# EAGLE design Tip_Tilt_Controller (EAGLE 9.4.2)
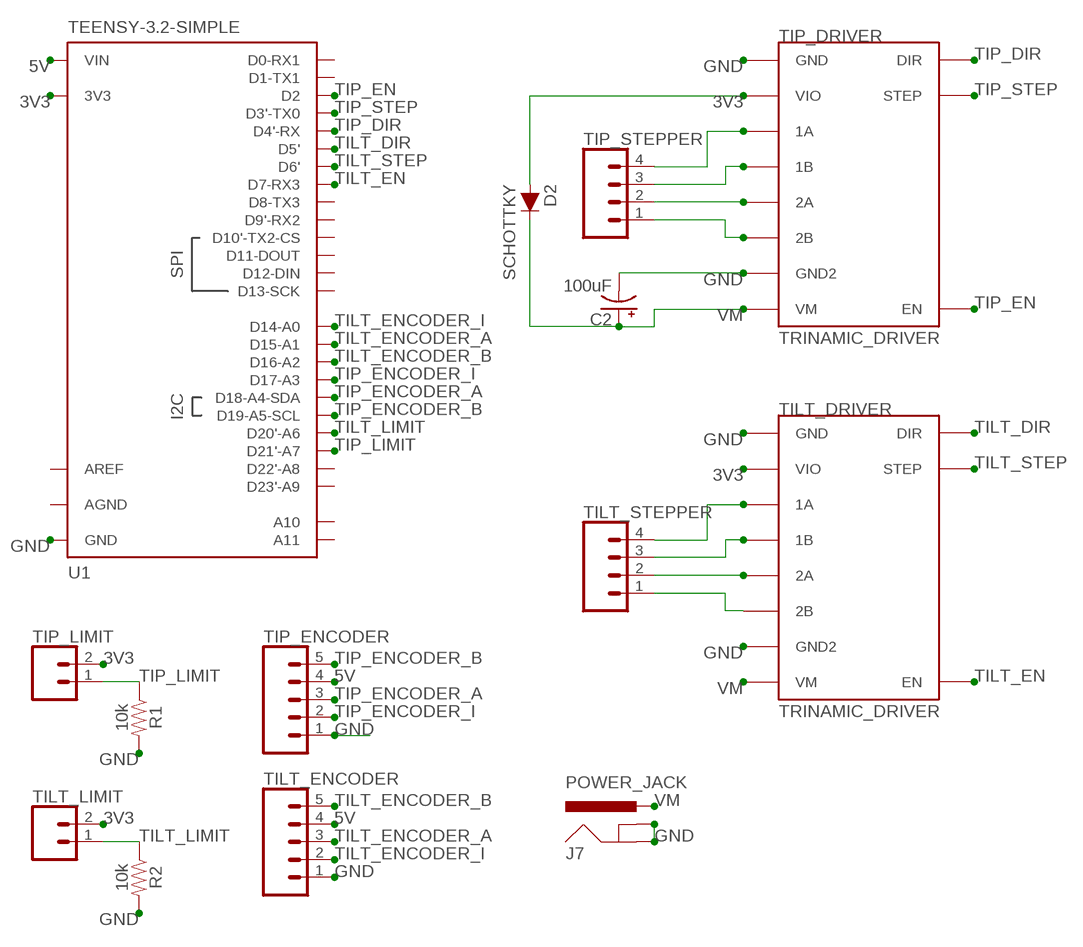
[diagram p0: schematic, sheet 1]

## Parts
C2  100uF  100UF-POLAR-RADIAL-2.5MM-25V-20%  [CPOL-RADIAL-2.5MM-6.5MM]
D2  SCHOTTKY  DIODE-1N4148  [DIODE-1N4148]
J7  POWER_JACK  [POWER_JACK_PTH]
R1  10k  10KOHM-HORIZ-1/6W-5%  [AXIAL-0.3]
R2  10k  10KOHM-HORIZ-1/6W-5%  [AXIAL-0.3]
TILT_DRIVER  TRINAMIC_DRIVER  [TRINAMIC_DRIVER]
TILT_ENCODER  CONN_05  [1X05]
TILT_LIMIT  CONN_02  [1X02]
TILT_STEPPER  CONN_04PTH  [1X04]
TIP_DRIVER  TRINAMIC_DRIVER  [TRINAMIC_DRIVER]
TIP_ENCODER  CONN_05  [1X05]
TIP_LIMIT  CONN_02  [1X02]
TIP_STEPPER  CONN_04PTH  [1X04]
U1  TEENSY-3.2-SIMPLE  [TEENSY-3.2-SIMPLE]

## Nets
3V3: D2.A TILT_DRIVER.5V(VIO) TILT_LIMIT.2 TIP_DRIVER.5V(VIO) TIP_LIMIT.2 U1.3.3V(3V3)
5V: TILT_ENCODER.4 TIP_ENCODER.4 U1.VIN
GND: C2.2(-) J7.GND J7.GNDBREAK R1.P$2 R2.P$2 TILT_DRIVER.GND TILT_DRIVER.GND2 TILT_ENCODER.1 TIP_DRIVER.GND TIP_DRIVER.GND2 TIP_ENCODER.1 U1.GND
N$10: TIP_DRIVER.1A TIP_STEPPER.4
N$11: TIP_DRIVER.1B TIP_STEPPER.3
N$12: TIP_DRIVER.2A TIP_STEPPER.2
N$13: TIP_DRIVER.2B TIP_STEPPER.1
N$18: TILT_DRIVER.1A TILT_STEPPER.4
N$19: TILT_DRIVER.1B TILT_STEPPER.3
N$20: TILT_DRIVER.2A TILT_STEPPER.2
N$21: TILT_DRIVER.2B TILT_STEPPER.1
TILT_DIR: TILT_DRIVER.DIR U1.5(D5')
TILT_EN: TILT_DRIVER.EN U1.7(D7-RX3)
TILT_ENCODER_A: TILT_ENCODER.3 U1.15(D15-A1)
TILT_ENCODER_B: TILT_ENCODER.5 U1.16(D16-A2)
TILT_ENCODER_I: TILT_ENCODER.2 U1.14(D14-A0)
TILT_LIMIT: R2.P$1 TILT_LIMIT.1 U1.20(D20'-A6)
TILT_STEP: TILT_DRIVER.STEP U1.6(D6')
TIP_DIR: TIP_DRIVER.DIR U1.4(D4'-RX)
TIP_EN: TIP_DRIVER.EN U1.2(D2)
TIP_ENCODER_A: TIP_ENCODER.3 U1.18(D18-A4-SDA)
TIP_ENCODER_B: TIP_ENCODER.5 U1.19(D19-A5-SCL)
TIP_ENCODER_I: TIP_ENCODER.2 U1.17(D17-A3)
TIP_LIMIT: R1.P$1 TIP_LIMIT.1 U1.21(D21'-A7)
TIP_STEP: TIP_DRIVER.STEP U1.3(D3'-TX0)
VM: C2.1(+) D2.C J7.PWR TILT_DRIVER.VM TIP_DRIVER.VM
Unconnected: U1.0(D0-RX1) U1.1(D1-TX1) U1.8(D8-TX3) U1.9(D9'-RX2) U1.10(D10'-TX2-CS) U1.11(D11-DOUT) U1.12(D12-DIN) U1.13(D13-SCK) U1.22(D22'-A8) U1.23(D23'-A9) U1.A10 U1.A11

## Power pins joined to a net without a drawn wire
AGND: U1.AGND
AREF: U1.AREF

## Library data of the parts
C2 = SparkFun-Capacitors:100UF-POLAR: 100µF polarized capacitors A capacitor is a passive two-terminal electrical component used to store electrical energy temporarily in an electric field.; PROD_ID: CAP-08439
D2 = SparkFun-DiscreteSemi:DIODE: Diode These are standard reverse protection diodes and small signal diodes. SparkFun Products: SparkFun SparkPunk Sound Kit <https://www.sparkfun.com/products/11177> SparkFun ESP8266 Thing <https://www.sparkfun.com/products/13231>; PROD_ID: DIO-08378; VALUE: 200mA/100V/1V
J7 = SparkFun-Connectors:POWER_JACK: Power Jack Connector This is the standard 5.5mm barrel jack for power. The PTH is the most common, proven, reliable, footprint. The Slot footprint only works if the mill layer is transmitted to the PCB fab house so be warned. Here are the connectors we sell at SparkFun: DC Barrel Power Jack/Connector <https://www.sparkfun.com/products/119> (PRT-00119) DC Barrel Power Jack/Connector (SMD) <https://www.sparkfun.com/products/12748> (PRT-12748) DC Barrel Jack Adapter - Breadboard Compatible <https://www.sparkfun.com/products/10811> (PRT-10811) It is used on this SparkFun product (and many, many others): SparkFun RedBoard - Programmed with Arduino <https://www.sparkfun.com/products/12757> (DEV-12757) Also, if you need a mating power supply or connector, please check these out: Wall Adapter Power Supply - 9VDC 650mA <https://www.sparkfun.com/products/298> (TOL-00298) DC Barrel Jack Adapter - Male <https://www.sparkfun.com/products/10287> (PRT-10287); PROD_ID: CONN-08197
R1 R2 = SparkFun-Resistors:10KOHM: 10kΩ resistor A resistor is a passive two-terminal electrical component that implements electrical resistance as a circuit element. Resistors act to reduce current flow, and, at the same time, act to lower voltage levels within circuits. - Wikipedia; PROD_ID: RES-08375
TILT_DRIVER TIP_DRIVER = My Library:TRINAMIC_DRIVER
TILT_ENCODER TIP_ENCODER = SparkFun-Connectors:CONN_05: Multi connection point. Often used as Generic Header-pin footprint for 0.1 inch spaced/style header connections On any of the 0.1 inch spaced packages, you can populate with these: Break Away Headers - Straight <https://www.sparkfun.com/products/116> (PRT-00116) Break Away Male Headers - Right Angle <https://www.sparkfun.com/products/553> (PRT-00553) Female Headers <https://www.sparkfun.com/products/115> (PRT-00115) Break Away Headers - Machine Pin <https://www.sparkfun.com/products/117> (PRT-00117) Break Away Female Headers - Swiss Machine Pin <https://www.sparkfun.com/products/743> (PRT-00743) For SCREWTERMINALS and SPRING TERMINALS visit here: Screw Terimnals on SparkFun.com <https://www.sparkfun.com/search/results?term=Screw+Terminals> (5mm/3.5mm/2.54mm spacing) This device is also useful as a general connection point to wire up your design to another part of your project. Our various solder wires solder well into these plated through hole pads. Hook-Up Wire - Assortment (Stranded, 22 AWG) <https://www.sparkfun.com/products/11375> (PRT-11375) Hook-Up Wire - Assortment (Solid Core, 22 AWG) <https://www.sparkfun.com/products/11367> (PRT-11367) View the entire wire category on our website here <https://www.sparkfun.com/categories/141> Special notes: Molex polarized connector foot print use with SKU : PRT-08231 with associated crimp pins and housings. 1MM SMD Version SKU: PRT-10208
TILT_LIMIT TIP_LIMIT = SparkFun-Connectors:CONN_02: Multi connection point. Often used as Generic Header-pin footprint for 0.1 inch spaced/style header connections On any of the 0.1 inch spaced packages, you can populate with these: Break Away Headers - Straight <https://www.sparkfun.com/products/116> (PRT-00116) Break Away Male Headers - Right Angle <https://www.sparkfun.com/products/553> (PRT-00553) Female Headers <https://www.sparkfun.com/products/115> (PRT-00115) Break Away Headers - Machine Pin <https://www.sparkfun.com/products/117> (PRT-00117) Break Away Female Headers - Swiss Machine Pin <https://www.sparkfun.com/products/743> (PRT-00743) For SCREWTERMINALS and SPRING TERMINALS visit here: Screw Terimnals on SparkFun.com <https://www.sparkfun.com/search/results?term=Screw+Terminals> (5mm/3.5mm/2.54mm spacing) This device is also useful as a general connection point to wire up your design to another part of your project. Our various solder wires solder well into these plated through hole pads. Hook-Up Wire - Assortment (Stranded, 22 AWG) <https://www.sparkfun.com/products/11375> (PRT-11375) Hook-Up Wire - Assortment (Solid Core, 22 AWG) <https://www.sparkfun.com/products/11367> (PRT-11367) View the entire wire category on our website here <https://www.sparkfun.com/categories/141> Special notes: Molex polarized connector foot print use with: PRT-08233 with associated crimp pins and housings. 2.54_SCREWTERM for use with PRT-10571. 3.5mm Screw Terminal footprints for PRT-08084 5mm Screw Terminal footprints for use with PRT-08432
TILT_STEPPER TIP_STEPPER = SparkFun-Connectors:CONN_04: Multi connection point. Often used as Generic Header-pin footprint for 0.1 inch spaced/style header connections On any of the 0.1 inch spaced packages, you can populate with these: Break Away Headers - Straight <https://www.sparkfun.com/products/116> (PRT-00116) Break Away Male Headers - Right Angle <https://www.sparkfun.com/products/553> (PRT-00553) Female Headers <https://www.sparkfun.com/products/115> (PRT-00115) Break Away Headers - Machine Pin <https://www.sparkfun.com/products/117> (PRT-00117) Break Away Female Headers - Swiss Machine Pin <https://www.sparkfun.com/products/743> (PRT-00743) For SCREWTERMINALS and SPRING TERMINALS visit here: Screw Terimnals on SparkFun.com <https://www.sparkfun.com/search/results?term=Screw+Terminals> (5mm/3.5mm/2.54mm spacing) This device is also useful as a general connection point to wire up your design to another part of your project. Our various solder wires solder well into these plated through hole pads. Hook-Up Wire - Assortment (Stranded, 22 AWG) <https://www.sparkfun.com/products/11375> (PRT-11375) Hook-Up Wire - Assortment (Solid Core, 22 AWG) <https://www.sparkfun.com/products/11367> (PRT-11367) View the entire wire category on our website here <https://www.sparkfun.com/categories/141> Special notes: Molex polarized connector foot print use with SKU : PRT-08231 with associated crimp pins and housings. 1MM SMD Version SKU: PRT-10208; PROD_ID: CONN-09696
U1 = nordin-pga and filter:TEENSY-3.2-SIMPLE

## Board
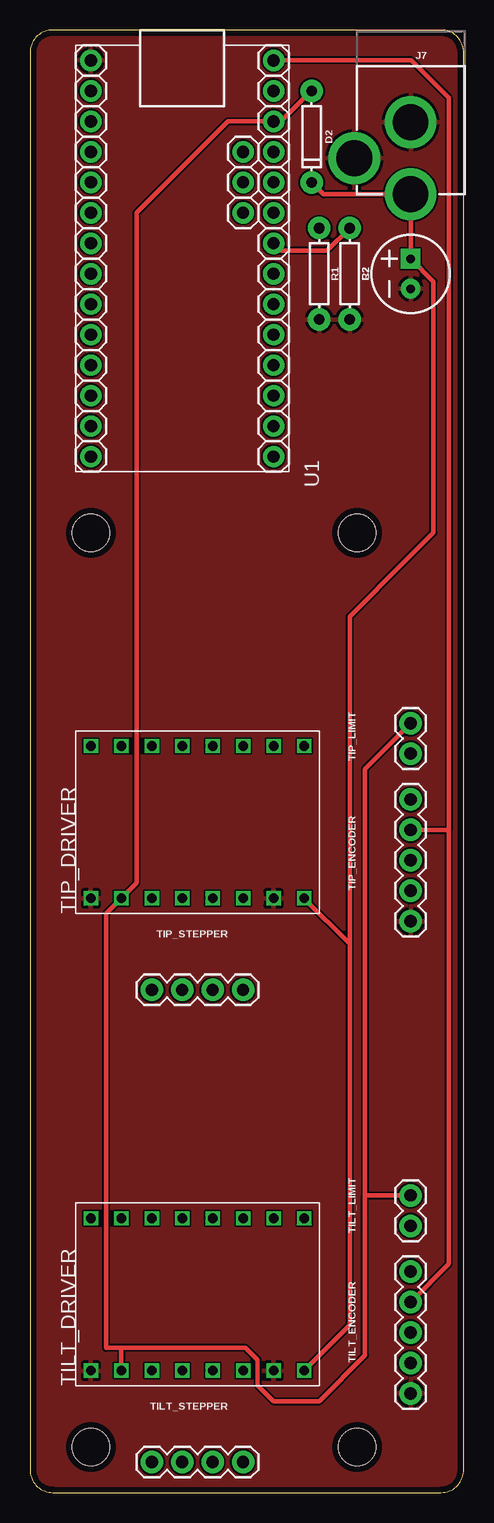
[diagram p1: board, top side]
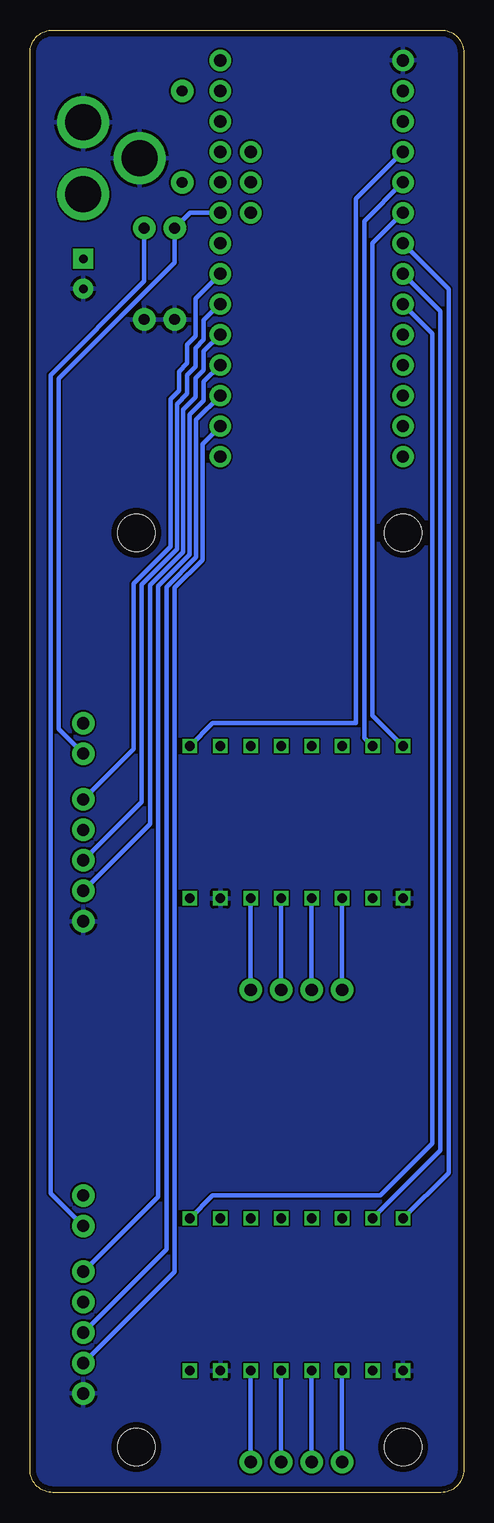
[diagram p2: board, bottom side, seen from below]

Size 36.2 x 121.92 mm. Coordinates in mm from the lower left corner, seen from the top.
Outline: 36.2,1.91 36.2,120.02 arc90 34.29,121.92 1.91,121.92 arc90 0,120.02 0,1.91 arc90 1.91,0 34.29,0 arc90 36.2,1.91
Copper layers (1*16): Top 0.035mm / dielectric 1.6mm / Bottom 0.035mm
Design rules "Elecrow_2-layer_PCB_eagle_rule": minimum track width 6mil, minimum drill 12mil, track to track 6mil, track to pad 6mil, pad to pad 6mil, via to via 8mil, smd to smd 0mil, copper to edge 20mil, drill to drill 10mil, minimum pad ring 6mil, minimum via ring 6mil, stop-mask expansion 0mil, vias tented up to drill 100mil, thermal gap 10mil
Holes 3.1 mm at 5.08,3.81 27.3,3.81 5.08,80.01 27.3,80.01

### Footprints (pad centres in the part's own frame; a part is rotated, then mirrored left to right if it is on the bottom)
CPOL-RADIAL-2.5MM-6.5MM = drill 0.7 pad 1.651 square: 1 1.25,0 | drill 0.7 pad 1.651: 2 -1.25,0
DIODE-1N4148 = drill 0.9 pad 1.88: A -3.81,0; C 3.81,0
POWER_JACK_PTH = drill 2.997 pad 4.318: GND 0,7.7; GNDBREAK 4.7,10.7; PWR 0,13.7
AXIAL-0.3 = drill 0.9 pad 1.88: P$1 -3.81,0; P$2 3.81,0
TRINAMIC_DRIVER = drill 0.8 square: 1A 1.27,13.97; 1B 1.27,11.43; 2A 1.27,8.89; 2B 1.27,6.35; 5V 1.27,16.51; DIR 13.97,19.05; EN 13.97,1.27; GND 1.27,3.81; GND2 1.27,19.05; P$10 13.97,3.81; P$11 13.97,6.35; P$12 13.97,8.89; P$13 13.97,11.43; P$14 13.97,13.97; STEP 13.97,16.51; VM 1.27,1.27
1X05 = drill 1.016 pad 1.88: 1 0,0; 2 2.54,0; 3 5.08,0; 4 7.62,0; 5 10.16,0
1X02 = drill 1.016 pad 1.88: 1 0,0; 2 2.54,0
1X04 = drill 1.016 pad 1.88: 1 0,0; 2 2.54,0; 3 5.08,0; 4 7.62,0
TEENSY-3.2-SIMPLE = drill 1.016 pad 1.778: 0 -7.62,13.97; 1 -7.62,11.43; 2 -7.62,8.89; 3 -7.62,6.35; 3.3V 7.62,11.43; 4 -7.62,3.81; 5 -7.62,1.27; 6 -7.62,-1.27; 7 -7.62,-3.81; 8 -7.62,-6.35; 9 -7.62,-8.89; 10 -7.62,-11.43; 11 -7.62,-13.97; 12 -7.62,-16.51; 13 7.62,-16.51; 14 7.62,-13.97; 15 7.62,-11.43; 16 7.62,-8.89; 17 7.62,-6.35; 18 7.62,-3.81; 19 7.62,-1.27; 20 7.62,1.27; 21 7.62,3.81; 22 7.62,6.35; 23 7.62,8.89; A10 5.08,6.35; A11 5.08,3.81; AGND 7.62,13.97; AREF 5.08,8.89; GND -7.62,16.51; VIN 7.62,16.51

### Placement (x,y rotation side)
C2  31.75,101.6 90 top
D2  23.5,113.03 270 top
J7  31.75,121.92 180 top
R1  24.13,101.6 270 top
R2  26.67,101.6 270 top
TILT_DRIVER  24.13,8.89 90 top
TILT_ENCODER  31.75,8.26 90 top
TILT_LIMIT  31.75,22.23 90 top
TILT_STEPPER  17.78,2.54 180 top
TIP_DRIVER  24.13,48.26 90 top
TIP_ENCODER  31.75,47.62 90 top
TIP_LIMIT  31.75,61.59 90 top
TIP_STEPPER  17.78,41.91 180 top
U1  12.7,102.87 0 top

### Tracks (layer width: path | path; a pad name or v marks a point on that pad's centre or on a via)
3V3
  Top 0.381: TIP_LIMIT.2 27.94,60.33 27.94,24.77 | 27.94,24.77 TILT_LIMIT.2 | 27.94,24.77 27.94,11.43 24.13,7.62 20.32,7.62 18.98,8.96 18.98,11.07 17.98,12.06 7.62,12.06 | 7.62,12.06 6.35,12.06 6.35,48.26 TIP_DRIVER.5V 8.89,50.8 8.89,106.68 16.51,114.3 U1.3.3V 20.95,114.3 D2.A | 7.62,12.06 TILT_DRIVER.5V
5V
  Top 0.381: TIP_ENCODER.4 34.92,55.24 | U1.VIN 31.8,119.38 34.92,116.26 34.92,55.24 | TILT_ENCODER.4 34.92,19.05 34.92,55.24
GND
  pour Top: -3.17,123.19 -3.17,-1.91 38.1,-1.91 38.1,123.58
  pour Bottom: -1.91,122.56 -1.91,-0.64 36.83,-0.64 36.83,122.56
N$10
  Bottom 0.381: TIP_DRIVER.1A TIP_STEPPER.4
N$11
  Bottom 0.381: TIP_STEPPER.3 TIP_DRIVER.1B
N$12
  Bottom 0.381: TIP_DRIVER.2A TIP_STEPPER.2
N$13
  Bottom 0.381: TIP_STEPPER.1 TIP_DRIVER.2B
N$18
  Bottom 0.381: TILT_STEPPER.4 TILT_DRIVER.1A
N$19
  Bottom 0.381: TILT_DRIVER.1B TILT_STEPPER.3
N$20
  Bottom 0.381: TILT_STEPPER.2 TILT_DRIVER.2A
N$21
  Bottom 0.381: TILT_DRIVER.2B TILT_STEPPER.1
TILT_DIR
  Bottom 0.381: TILT_DRIVER.DIR 1.27,26.67 1.27,100.33 U1.5
TILT_EN
  Bottom 0.381: TILT_DRIVER.EN 20.95,24.77 6.99,24.77 2.64,29.11 2.64,96.62 U1.7
TILT_ENCODER_A
  Bottom 0.381: TILT_ENCODER.3 24.82,20.27 24.82,75.5 22.34,77.97 22.34,87.85 22.34,89.42 U1.15
TILT_ENCODER_B
  Bottom 0.381: TILT_ENCODER.5 25.5,24.66 25.5,75.56 22.88,78.19 22.88,89.85 21.7,91.03 21.7,92.6 U1.16
TILT_ENCODER_I
  Bottom 0.381: TILT_ENCODER.2 24.13,18.41 24.13,75.43 21.81,77.75 21.81,87.41 U1.14
TILT_LIMIT
  Top 0.381: R2.P$1 24.77,103.5 20.95,103.5 U1.20
  Bottom 0.381: TILT_LIMIT.1 34.48,24.96 34.48,93.15 26.67,100.97 R2.P$1
TILT_STEP
  Bottom 0.381: TILT_DRIVER.STEP 1.96,28.52 1.96,98.48 U1.6
TIP_DIR
  Bottom 0.381: TIP_DRIVER.DIR 7.62,64.77 7.62,104.14 U1.4
TIP_EN
  Bottom 0.381: TIP_DRIVER.EN 20.95,64.14 8.99,64.14 8.99,107.85 U1.2
TIP_ENCODER_A
  Bottom 0.381: TIP_ENCODER.3 26.87,57.58 26.87,75.7 23.94,78.63 23.94,90.72 23.08,91.59 23.08,93.16 22.39,93.85 22.39,95.42 21.7,96.11 21.7,97.73 20.37,99.06 U1.18
TIP_ENCODER_B
  Bottom 0.381: U1.19 22.39,99.53 22.39,96.39 23.08,95.7 23.08,94.13 23.76,93.45 23.76,91.88 24.48,91.16 24.48,78.85 27.56,75.77 27.56,61.98 TIP_ENCODER.5
TIP_ENCODER_I
  Bottom 0.381: TIP_ENCODER.2 26.19,55.73 26.19,75.63 23.41,78.41 23.41,90.29 22.39,91.31 22.39,92.88 21.7,93.57 21.7,95.14 U1.17
TIP_LIMIT
  Bottom 0.381: TIP_LIMIT.1 33.8,63.64 33.8,92.87 24.13,102.53 R1.P$1 22.86,106.68 U1.21
TIP_STEP
  Bottom 0.381: TIP_DRIVER.STEP 8.31,62.92 8.31,105.99 U1.3
VM
  Top 0.381: TILT_DRIVER.VM 26.67,13.97 26.67,45.72 | 26.67,45.72 TIP_DRIVER.VM | D2.C 24.5,108.22 J7.PWR C2.1 33.66,100.94 33.66,80 31.41,77.76 26.67,73.03 26.67,45.72